# EAGLE design S12G_Micro_20EVB_RevA (EAGLE 6.1)
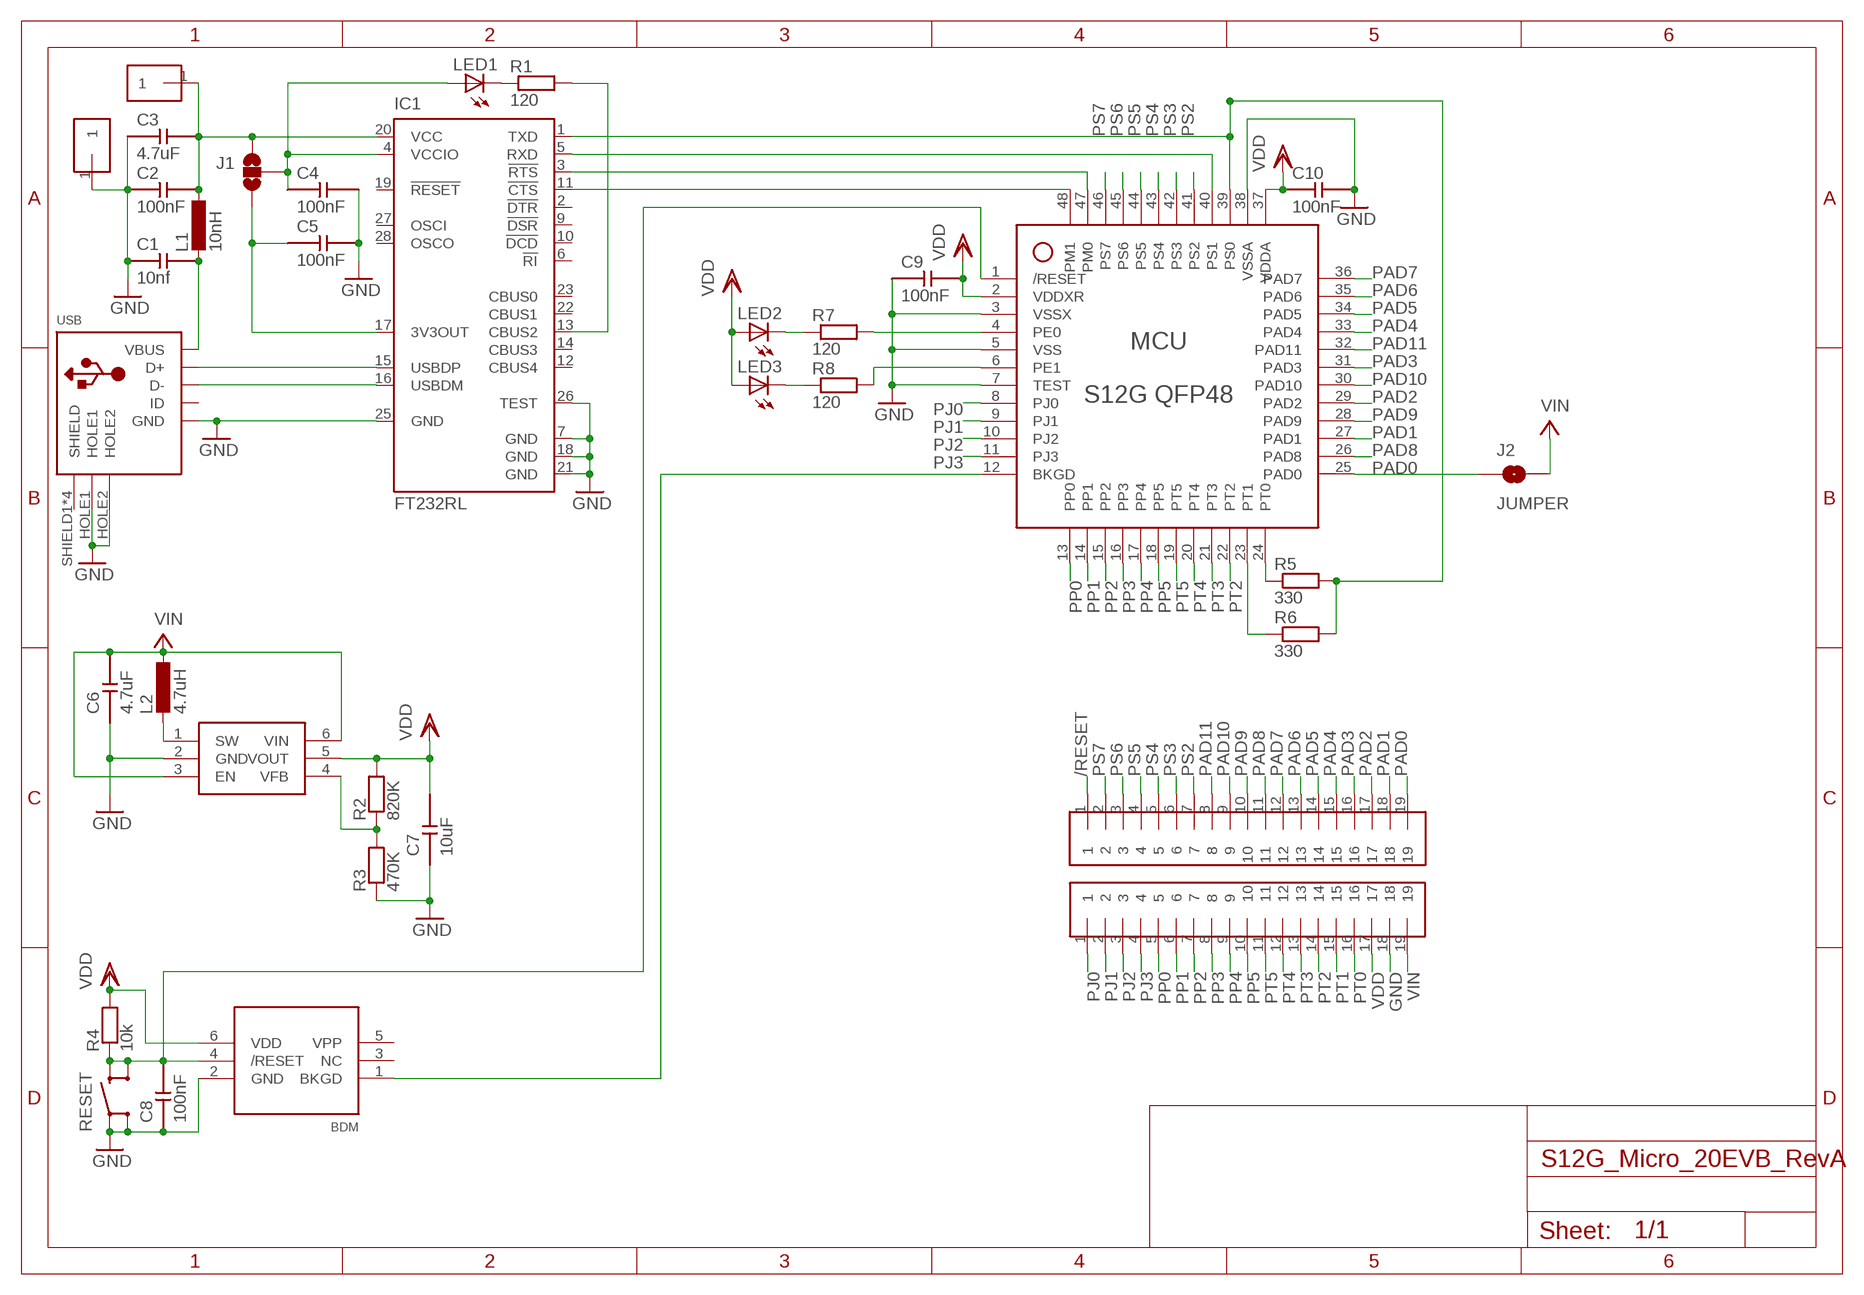
[diagram p0: schematic, sheet 1]

## Parts
BDM  BDM  [BDM]
BOTTOM  1X19  [1X19]
C1  10nf  C  [0805]
C2  100nF  C  [0805]
C3  4.7uF  C  [0805]
C4  100nF  C  [0805]
C5  100nF  C  [0805]
C6  4.7uF  C  [0805]
C7  10uF  C  [0805]
C8  100nF  C  [0805]
C9  100nF  C  [0805]
C10  100nF  C  [0805]
GND  1X1  [1X1]
IC1  FT232RL  [SSOP28]
IC2  MCP1640  [SOT23-6]
J1  JUMPER_2WAY  [JUMPER_2WAY]
J2  JUMPER  [JUMPER]
L1  10nH  L0805  [0805]
L2  4.7uH  LQH3C  [LQH3C@1]
LED1  LED0805  [0805]
LED2  LED0805  [0805]
LED3  LED0805  [0805]
MCU  S12G QFP48  S12G_QFP48  [QFP44]
R1  120  R  [0805]
R2  820K  R  [0805]
R3  470K  R  [0805]
R4  10k  R  [0805]
R5  330  R  [0805]
R6  330  R  [0805]
R7  120  R  [0805]
R8  120  R  [0805]
RESET  BUTTON  [BUTTON]
TOP  1X19  [1X19]
USB  USB  [USB_MINI_B]
VUSB  1X1  [1X1]

## Nets
3V3OUT: C5.2 IC1.17(3V3OUT) J1.3
/RESET: BDM.4(/RESET) C8.1 MCU.1(/RESET) R4.2 RESET.2 RESET.4 TOP.1
BKGD: BDM.1(BKGD) MCU.12(BKGD)
CTS: IC1.11(!CTS) MCU.48(PM1)
GND: BDM.2(GND) BOTTOM.18 C1.2 C2.2 C3.2 C4.1 C5.1 C6.2 C7.2 C8.2 C9.2 C10.1 GND.1 IC1.7(GND) IC1.18(GND) IC1.21(GND) IC1.25(GND) IC1.26(TEST) IC2.2(GND) MCU.3(VSSX) MCU.5(VSS) MCU.7(TEST) MCU.38(VSSA) R3.2 RESET.1 RESET.3 USB.GND USB.HOLE1 USB.HOLE2
N$1: LED3.2(C) R8.2
N$2: IC2.4(VFB) R2.2 R3.1
N$3: LED2.2(C) R7.2
N$8: LED1.2(C) R1.2
N$9: IC1.13(CBUS2) R1.1
N$11: IC2.1(SW) L2.3 L2.4
PAD0: J2.1 MCU.25(PAD0) TOP.19
PAD1: MCU.27(PAD1) TOP.18
PAD2: MCU.29(PAD2) TOP.17
PAD3: MCU.31(PAD3) TOP.16
PAD4: MCU.33(PAD4) TOP.15
PAD5: MCU.34(PAD5) TOP.14
PAD6: MCU.35(PAD6) TOP.13
PAD7: MCU.36(PAD7) TOP.12
PAD8: MCU.26(PAD8) TOP.11
PAD9: MCU.28(PAD9) TOP.10
PAD10: MCU.30(PAD10) TOP.9
PAD11: MCU.32(PAD11) TOP.8
PE0: MCU.4(PE0) R7.1
PE1: MCU.6(PE1) R8.1
PJ0: BOTTOM.1 MCU.8(PJ0)
PJ1: BOTTOM.2 MCU.9(PJ1)
PJ2: BOTTOM.3 MCU.10(PJ2)
PJ3: BOTTOM.4 MCU.11(PJ3)
PP0: BOTTOM.5 MCU.13(PP0)
PP1: BOTTOM.6 MCU.14(PP1)
PP2: BOTTOM.7 MCU.15(PP2)
PP3: BOTTOM.8 MCU.16(PP3)
PP4: BOTTOM.9 MCU.17(PP4)
PP5: BOTTOM.10 MCU.18(PP5)
PS2: MCU.41(PS2) TOP.7
PS3: MCU.42(PS3) TOP.6
PS4: MCU.43(PS4) TOP.5
PS5: MCU.44(PS5) TOP.4
PS6: MCU.45(PS6) TOP.3
PS7: MCU.46(PS7) TOP.2
PT0: BOTTOM.16 MCU.24(PT0) R5.2
PT1: BOTTOM.15 MCU.23(PT1) R6.2
PT2: BOTTOM.14 MCU.22(PT2)
PT3: BOTTOM.13 MCU.21(PT3)
PT4: BOTTOM.12 MCU.20(PT4)
PT5: BOTTOM.11 MCU.19(PT5)
RTS: IC1.3(!RTS) MCU.47(PM0)
RXD: IC1.1(TXD) MCU.39(PS0) R5.1 R6.1
TXD: IC1.5(RXD) MCU.40(PS1)
USBDN: IC1.16(USBDM) USB.D-
USBDP: IC1.15(USBDP) USB.D+
VBUS: C1.1 L1.2 USB.VBUS
VCCIO: C4.2 IC1.4(VCCIO) J1.2 LED1.1(A)
VDD: BDM.6(VDD) BOTTOM.17 C7.1 C9.1 C10.2 IC2.5(VOUT) LED2.1(A) LED3.1(A) MCU.2(VDDXR) MCU.37(VDDA) R2.1 R4.1
VDDUSB: C2.1 C3.1 IC1.20(VCC) J1.1 L1.1 VUSB.1
VIN: BOTTOM.19 C6.1 IC2.3(EN) IC2.6(VIN) J2.2 L2.1 L2.5
Unconnected: BDM.3(NC) BDM.5(VPP) IC1.2(!DTR) IC1.6(!RI) IC1.9(!DSR) IC1.10(!DCD) IC1.12(CBUS4) IC1.14(CBUS3) IC1.19(!RESET) IC1.22(CBUS1) IC1.23(CBUS0) IC1.27(OSCI) IC1.28(OSCO) USB.ID

## Power pins joined to a net without a drawn wire
SHIELD: USB.SHIELD1(SHIELD) USB.SHIELD2(SHIELD) USB.SHIELD3(SHIELD) USB.SHIELD4(SHIELD)

## Library data of the parts
BDM = myLibrary:BDM
BOTTOM TOP = myLibrary:1X19
C1-C10 = myLibrary:C
GND VUSB = myLibrary:1X1
IC1 = ftdichip:FT232R: Source: http://www.ftdichip.com/Documents/DataSheets/DS_FT232R_v104.pdf; MPN: FT232RL; OC_FARNELL: 1146032; OC_NEWARK: 91K9918
IC2 = myLibrary:MCP1640
J1 = myLibrary:JUMPER_2WAY
J2 = myLibrary:JUMPER
L1 = myLibrary:L
L2 = myLibrary:LQH3C
LED1-LED3 = myLibrary:LED
MCU = myLibrary:S12G_QFP48
R1-R8 = myLibrary:R
RESET = myLibrary:BUTTON
USB = myLibrary:USB

## Board
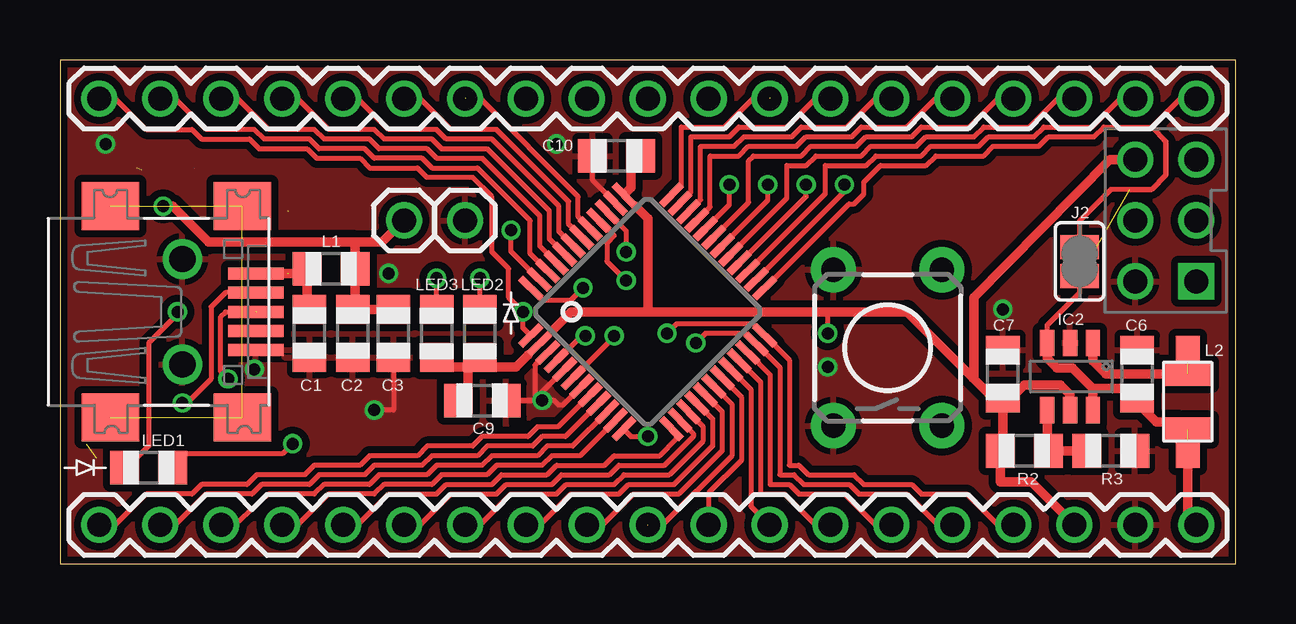
[diagram p1: board, top side]
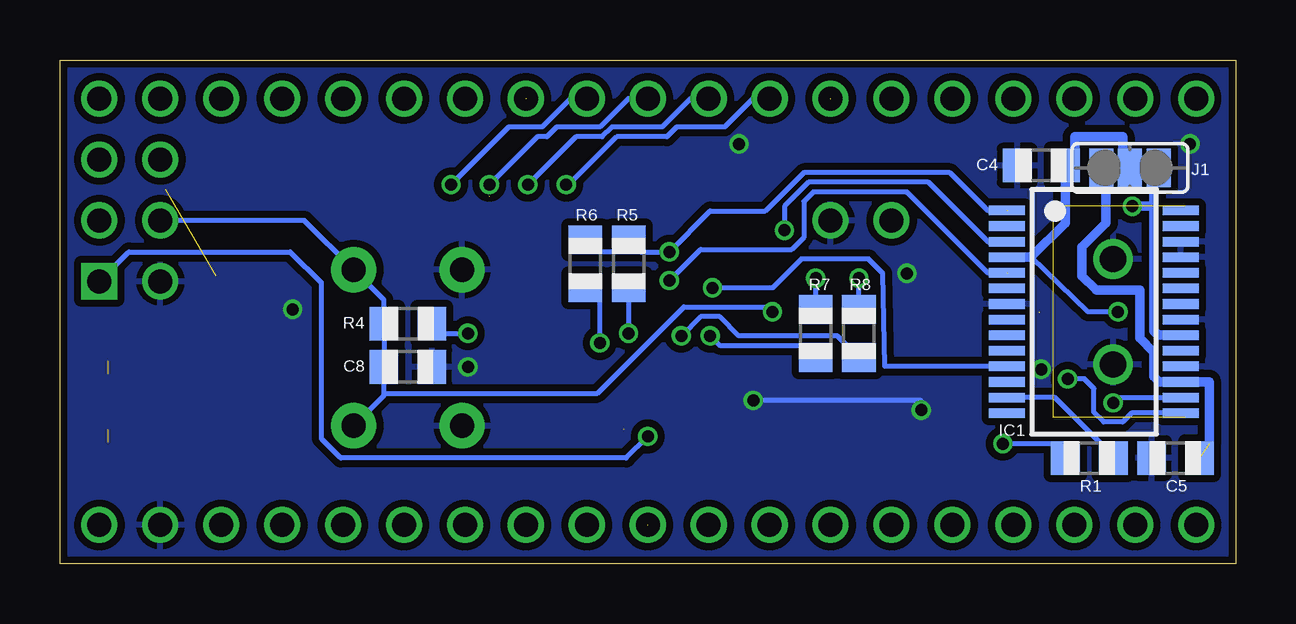
[diagram p2: board, bottom side, seen from below]

Size 49 x 21 mm. Coordinates in mm from the lower left corner, seen from the top.
Outline: 0,0 49,0 49,21 0,21 0,0
Copper layers (1*16): Top 0.035mm / dielectric 1.5mm / Bottom 0.035mm
Design rules: minimum track width 6mil, minimum drill 12mil, track to track 6mil, track to pad 6mil, pad to pad 6mil, via to via 6mil, smd to smd 0mil, copper to edge 10mil, drill to drill 10mil, minimum pad ring 10mil, minimum via ring 6mil, stop-mask expansion 2mil, vias tented up to drill 100mil, thermal gap 10mil

### Footprints (pad centres in the part's own frame; a part is rotated, then mirrored left to right if it is on the bottom)
BDM = drill 1 square: 1 -1.27,2.54 | drill 1: 2 1.27,2.54; 3 -1.27,0; 4 1.27,0; 5 -1.27,-2.54; 6 1.27,-2.54
1X19 = drill 1: 1 0,0; 2 2.54,0; 3 5.08,0; 4 7.62,0; 5 10.16,0; 6 12.7,0; 7 15.24,0; 8 17.78,0; 9 20.32,0; 10 22.86,0; 11 25.4,0; 12 27.94,0; 13 30.48,0; 14 33.02,0; 15 35.56,0; 16 38.1,0; 17 40.64,0; 18 43.18,0; 19 45.72,0
0805 = smd 1.2 x 1.4: 1 -1,0; 2 1,0
1X1 = drill 1: 1 0,0
SSOP28 = smd 0.4 x 1.5: 1 -4.225,-3.625; 2 -3.575,-3.625; 3 -2.925,-3.625; 4 -2.275,-3.625; 5 -1.625,-3.625; 6 -0.975,-3.625; 7 -0.325,-3.625; 8 0.325,-3.625; 9 0.975,-3.625; 10 1.625,-3.625; 11 2.275,-3.625; 12 2.925,-3.625; 13 3.575,-3.625; 14 4.225,-3.625; 15 4.225,3.625; 16 3.575,3.625; 17 2.925,3.625; 18 2.275,3.625; 19 1.625,3.625; 20 0.975,3.625; 21 0.325,3.625; 22 -0.325,3.625; 23 -0.975,3.625; 24 -1.625,3.625; 25 -2.275,3.625; 26 -2.925,3.625; 27 -3.575,3.625; 28 -4.225,3.625
SOT23-6 = smd 0.6 x 1.1: 1 -0.95,-1.4; 2 0,-1.4; 3 0.95,-1.4; 4 0.95,1.4; 5 0,1.4; 6 -0.95,1.4
JUMPER_2WAY = smd 1 x 1.6: 1 -1.2,0; 2 0,0; 3 1.2,0
JUMPER = smd 1 x 1.6: 1 -0.6,0; 2 0.6,0
LQH3C@1 = smd 1 x 2: 1 -1.1,0; 3 1.2,0 | smd 2.1 x 1: 4 1.75,0; 5 -1.65,0
QFP44 = smd 1.2 x 0.3: 1 -4.15,2.75; 2 -4.15,2.25; 3 -4.15,1.75; 4 -4.15,1.25; 5 -4.15,0.75; 6 -4.15,0.25; 7 -4.15,-0.25; 8 -4.15,-0.75; 9 -4.15,-1.25; 10 -4.15,-1.75; 11 -4.15,-2.25; 12 -4.15,-2.75; 25 4.15,-2.75; 26 4.15,-2.25; 27 4.15,-1.75; 28 4.15,-1.25; 29 4.15,-0.75; 30 4.15,-0.25; 31 4.15,0.25; 32 4.15,0.75; 33 4.15,1.25; 34 4.15,1.75; 35 4.15,2.25; 36 4.15,2.75 | smd 0.3 x 1.2: 13 -2.75,-4.15; 14 -2.25,-4.15; 15 -1.75,-4.15; 16 -1.25,-4.15; 17 -0.75,-4.15; 18 -0.25,-4.15; 19 0.25,-4.15; 20 0.75,-4.15; 21 1.25,-4.15; 22 1.75,-4.15; 23 2.25,-4.15; 24 2.75,-4.15; 37 2.75,4.15; 38 2.25,4.15; 39 1.75,4.15; 40 1.25,4.15; 41 0.75,4.15; 42 0.25,4.15; 43 -0.25,4.15; 44 -0.75,4.15; 45 -1.25,4.15; 46 -1.75,4.15; 47 -2.25,4.15; 48 -2.75,4.15
BUTTON = drill 1.016 pad 1.88: 1 -3.251,2.261; 2 -3.251,-2.261; 3 3.251,2.261; 4 3.251,-2.261
USB_MINI_B = smd 0.5 x 2.308: D+ 0,4.064; D- -0.8,4.064; GND 1.6,4.064; ID 0.8,4.064; VBUS -1.6,4.064 | drill 1.1: HOLE1 -2.2,1; HOLE2 2.2,1 | smd 2 x 2.4: SHIELD1 -4.4,-2; SHIELD2 -4.4,3.5; SHIELD3 4.4,3.5; SHIELD4 4.4,-2

### Placement (x,y rotation side)
BDM  46.09,14.31 180 top
BOTTOM  1.64,1.61 0 top
C1  10.4,9.6 270 top
C2  12.2,9.6 270 top
C3  13.9,9.6 270 top
C4  8.1,16.6 0 bottom
C5  2.5,4.4 0 bottom
C6  44.9,7.9 90 top
C7  39.3,7.9 90 top
C8  34.5,8.2 0 bottom
C9  17.6,6.8 0 top
C10  23.2,17 0 top
GND  16.88,14.31 0 top
IC1  5.9,10.5 270 bottom
IC2  42.1,7.8 180 top
J1  4.4,16.5 180 bottom
J2  42.5,12.6 270 top
L1  11.3,12.3 180 top
L2  47,6.7 90 top
LED1  3.7,4 0 top
LED2  17.5,9.6 90 top
LED3  15.7,9.6 90 top
MCU  24.5,10.5 45 top
R1  6.1,4.4 180 bottom
R2  40.2,4.7 0 top
R3  43.8,4.7 0 top
R4  34.5,10 180 bottom
R5  25.3,12.5 270 bottom
R6  27.1,12.5 270 bottom
R7  17.5,9.6 90 bottom
R8  15.7,9.6 90 bottom
RESET  34.5,9 90 top
TOP  1.64,19.39 0 top
USB  4.1,10.5 270 top
VUSB  14.34,14.31 0 top

### Tracks (layer width: path | path; a pad name or v marks a point on that pad's centre or on a via)
3V3OUT  (2 unrouted)
  Bottom 0.4: 1.1,5 1.1,7.57 IC1.17 3.17,7.57 3.4,7.8 3.4,8.8 4,9.4 4,11.4 5.8,11.4 6.4,12 6.4,13.2 5.4,14.2 5.4,16.29 5.6,16.48
/RESET  (via drill 0.5)
  Top 0.2: TOP.1 2.31,19.39 3.6,18.1 5.5,18.1 5.9,17.7 7.9,17.7 8.3,17.3 10.3,17.3 10.7,16.9 12.5,16.9 12.9,16.5 14.9,16.5 15.3,16.1 17.2,16.1 18,15.3 18,13 18.7,12.3 18.7,11.1 v19.3,10.5 19.3,9.83 MCU.1
  Bottom 0.2: RESET.2 35.5,7.01 35.5,7.1 | 35.5,7.1 C8.1 R4.2 35.5,10.99 RESET.4 38.82,14.31 BDM.4 | 35.5,7.1 26.6,7.1 23,10.7 19.5,10.7 v19.3,10.5
BKGD  (via drill 0.5)
  Top 0.2: MCU.12 23.5,5.6 23.8,5.3 v24.5,5.3
  Bottom 0.2: v24.5,5.3 25.4,4.4 37.3,4.4 38.1,5.2 38.1,11.7 39.4,13 46.13,13 BDM.1
CTS  (via drill 0.5)
  Top 0.2: MCU.48 20.11,11 21.3,11 v21.8,11.5
  Bottom 0.2: IC1.11 14.62,8.22 14.7,12.1 15.3,12.7 18.1,12.7 19.3,11.5 v21.8,11.5
GND  (via drill 0.5)
  Top 0.2: MCU.5 19.74,6.8 C9.2 | MCU.7 20.95,6.6 20.8,6.6 20.6,6.8 v20.1,6.8 C9.2 | MCU.3 19.8,8.28 19.8,6.8 C9.2 | MCU.38 22.2,15.98 C10.1 | C3.2 13.9,6.4 v13.1,6.4
  Bottom 0.2: v13.1,6.4 13.1,6.8 v20.1,6.8
  other vias: 20.7,17.5 39.3,10.6 32,8.2 1.9,17.5 13.7,12.1 8.1,8.1
  pour Bottom (isolate 0.3): 0.3,0.2 48.7,0.2 48.7,20.8 0.3,20.8
  pour Top (isolate 0.3): 0.3,0.2 48.7,0.2 48.7,20.8 0.3,20.8
N$1  (via drill 0.5)
  Top 0.2: LED3.2 v15.7,11.9
  Bottom 0.2: LED3.2 v15.7,11.9
N$2
  Top 0.4: R3.1 R2.2 41.15,4.75 IC2.4
N$3  (via drill 0.5)
  Top 0.2: R7.2 v17.5,11.9
  Bottom 0.2: R7.2 v17.5,11.9
N$8  (via drill 0.5)
  Top 0.2: LED1.2 5,4.3 5,4.6 9.3,4.6 v9.7,5
  Bottom 0.2: 7.1,4.3 R1.2 7.1,5 v9.7,5
N$9
  Bottom 0.2: R1.1 5.1,4.5 7.53,6.93 IC1.13
N$11  (1 unrouted)
  Top 0.4: 43.1,9.2 IC2.1 43.05,8.45 43.6,7.9 L2.3
PAD0
  Top 0.2: 45.5,18.2 46.69,19.39 TOP.19 | MCU.25 32.89,15 33.1,15 33.5,15.4 33.5,15.9 34.2,16.6 36.1,16.6 36.5,17 38.5,17 38.9,17.4 40.8,17.4 41.2,17.8 43.1,17.8 43.5,18.2 45.5,18.2 | J2.1 42.5,14.3 43.8,15.6 45.5,15.6 46.1,16.2 46.1,17.6 45.5,18.2
PAD1
  Top 0.2: TOP.18 44.19,19.39 43,18.2 41,18.2 40.6,17.8 38.7,17.8 38.3,17.4 36.3,17.4 35.9,17 34,17 33.6,16.6 31.9,16.6 31.9,15.43 MCU.27
PAD2
  Top 0.2: TOP.17 41.59,19.39 40.4,18.2 38.5,18.2 38.1,17.8 36.1,17.8 35.7,17.4 33.8,17.4 33.4,17 31.5,17 31.1,16.6 30.3,16.6 30.3,15.24 MCU.29
PAD3
  Top 0.2: TOP.16 39.09,19.39 37.9,18.2 35.9,18.2 35.5,17.8 33.6,17.8 33.2,17.4 31.3,17.4 30.9,17 28.9,17 28.7,16.8 28.7,15.05 MCU.31
PAD4
  Top 0.2: MCU.33 27.1,14.87 27.1,17 28.3,17 28.7,17.4 30.7,17.4 31.1,17.8 33,17.8 33.4,18.2 35.3,18.2 36.49,19.39 TOP.15
PAD5
  Top 0.2: MCU.34 26.7,15.18 26.7,17.4 28.1,17.4 28.5,17.8 30.5,17.8 30.9,18.2 32.8,18.2 33.99,19.39 TOP.14
PAD6
  Top 0.2: TOP.13 31.49,19.39 30.3,18.2 28.3,18.2 27.9,17.8 26.3,17.8 26.3,15.48 MCU.35
PAD7  (1 unrouted)
  Top 0.2: MCU.36 25.9,15.79 25.9,18.2 27.7,18.2 28.9,19.4 29.6,19.4
PAD8  (via drill 0.5)
  Top 0.2: MCU.26 32.7,15.52 v32.7,15.8
  Bottom 0.2: TOP.11 27.71,19.39 28.9,18.2 30.3,18.2 v32.7,15.8
PAD9  (via drill 0.5)  (1 unrouted)
  Top 0.2: 31.1,15.33 v31.1,15.8 | MCU.28 28.35,12.55 31.1,15.3
  Bottom 0.2: TOP.10 25.31,19.39 26.5,18.2 28.3,18.2 28.7,17.8 29.1,17.8 v31.1,15.8
PAD10  (via drill 0.5)
  Top 0.2: MCU.30 29.5,15.15 v29.5,15.8
  Bottom 0.2: TOP.9 22.71,19.39 23.9,18.2 26,18.2 26.4,17.8 27.5,17.8 v29.5,15.8
PAD11  (via drill 0.5)
  Top 0.2: MCU.32 27.9,14.96 v27.9,15.8
  Bottom 0.2: TOP.8 20.11,19.39 21.3,18.2 23.3,18.2 23.7,17.8 25.8,17.8 27.8,15.8 v27.9,15.8
PE0  (via drill 0.5)
  Top 0.2: MCU.4 21.73,9.5 v21.9,9.5
  Bottom 0.2: 17.5,9.1 R7.1 18,9.1 21.5,9.1 v21.9,9.5
PE1  (via drill 0.5)
  Top 0.2: MCU.6 23.1,9.45 v23.1,9.5
  Bottom 0.2: R8.1 16.6,9.5 20.7,9.5 21.5,10.3 22.3,10.3 v23.1,9.5
PJ0
  Top 0.2: MCU.8 20.76,5.7 19.9,5.7 19.5,5.3 17.6,5.3 17.2,4.9 15.3,4.9 14.9,4.5 12.9,4.5 12.5,4.1 10.6,4.1 10.2,3.7 8.2,3.7 7.8,3.3 5.9,3.3 5.5,2.9 3.6,2.9 2.31,1.61 BOTTOM.1
PJ1
  Top 0.2: BOTTOM.2 4.81,1.61 6.1,2.9 8,2.9 8.4,3.3 10.4,3.3 10.8,3.7 12.7,3.7 13.1,4.1 15.1,4.1 15.5,4.5 17.4,4.5 17.8,4.9 19.7,4.9 20.1,5.3 21.07,5.3 MCU.9
PJ2
  Top 0.2: BOTTOM.3 7.31,1.61 8.7,2.9 10.6,2.9 11,3.3 12.9,3.3 13.3,3.7 15.3,3.7 15.7,4.1 17.6,4.1 18,4.5 19.9,4.5 20.3,4.9 21.38,4.9 MCU.10
PJ3
  Top 0.2: BOTTOM.4 9.91,1.61 11.2,2.9 13.1,2.9 13.5,3.3 15.5,3.3 15.9,3.7 17.8,3.7 18.2,4.1 20.1,4.1 20.5,4.5 21.68,4.5 MCU.11
PP0  (1 unrouted)
  Top 0.2: BOTTOM.5 12.41,1.61 13.7,2.9 15.7,2.9 16.1,3.3 18,3.3 18.4,3.7 20.3,3.7 20.7,4.1 22.7,4.1 23.1,4.5 25,4.5 25.7,5.2 25.7,5.4 25.5,5.6
PP1
  Top 0.2: MCU.14 26.4,5.42 26.4,5.3 25.2,4.1 23.3,4.1 22.9,3.7 20.9,3.7 20.5,3.3 18.6,3.3 18.2,2.9 16.3,2.9 15.01,1.61 BOTTOM.6
PP2
  Top 0.2: MCU.15 26.8,5.72 26.8,5.1 25.4,3.7 23.5,3.7 23.1,3.3 21.1,3.3 20.7,2.9 18.8,2.9 17.51,1.61 BOTTOM.7
PP3
  Top 0.2: MCU.16 27.2,6.03 27.2,4.9 25.6,3.3 23.7,3.3 23.3,2.9 21.3,2.9 20.01,1.61 BOTTOM.8
PP4
  Top 0.2: MCU.17 27.6,6.34 27.6,4.7 25.8,2.9 23.9,2.9 22.61,1.61 BOTTOM.9
PP5  (1 unrouted)
  Top 0.2: MCU.18 28,6.65 28,4.5 25.1,1.6 BOTTOM.10
PS2  (1 unrouted)
  Top 0.2: MCU.41 21.6,14.46 21.6,15.3 17.5,19.4 16.9,19.4
PS3
  Top 0.2: TOP.6 15.01,19.39 16.3,18.1 18.2,18.1 21.2,15.1 21.2,14.15 MCU.42
PS4
  Top 0.2: TOP.5 12.41,19.39 13.7,18.1 15.7,18.1 16.1,17.7 18,17.7 20.8,14.9 20.8,13.85 MCU.43
PS5
  Top 0.2: TOP.4 9.91,19.39 11.2,18.1 13.1,18.1 13.5,17.7 15.5,17.7 15.9,17.3 17.8,17.3 20.4,14.7 20.4,13.54 MCU.44
PS6
  Top 0.2: TOP.3 7.41,19.39 8.7,18.1 10.6,18.1 11,17.7 12.9,17.7 13.3,17.3 15.3,17.3 15.7,16.9 17.6,16.9 20,14.5 20,13.23 MCU.45
PS7
  Top 0.2: TOP.2 4.81,19.39 6.1,18.1 8.1,18.1 8.5,17.7 10.4,17.7 10.8,17.3 12.7,17.3 13.1,16.9 15.1,16.9 15.5,16.5 17.4,16.5 19.6,14.3 19.6,12.93 MCU.46
PT0  (via drill 0.5)
  Top 0.2: BOTTOM.16 39.09,1.61 37.8,2.9 35.9,2.9 35.5,3.3 33.5,3.3 33.1,3.7 31.2,3.7 30.8,4.1 30.4,4.1 30.4,8.49 MCU.24 28.89,10 25.7,10 v25.3,9.6
  Bottom 0.2: R5.2 v25.3,9.6
PT1  (via drill 0.5)
  Top 0.2: BOTTOM.15 36.59,1.61 35.3,2.9 33.3,2.9 32.9,3.3 31,3.3 30.6,3.7 30,3.7 30,8.18 MCU.23 28.58,9.6 26.9,9.6 v26.5,9.2
  Bottom 0.2: v26.5,9.2 26.5,10.9 arc-90 R6.2
PT2
  Top 0.2: MCU.22 29.6,7.88 29.6,3.3 30.4,3.3 30.8,2.9 32.7,2.9 33.99,1.61 BOTTOM.14
PT3
  Top 0.2: MCU.21 29.2,7.57 29.2,2.9 30.2,2.9 31.49,1.61 BOTTOM.13
PT4
  Top 0.2: MCU.20 28.8,7.26 28.8,2.39 BOTTOM.12
PT5
  Top 0.2: MCU.19 28.4,6.95 28.4,4.3 27.04,2.94 BOTTOM.11
RTS  (via drill 0.5)
  Top 0.2: MCU.47 18.8,13.02 v18.8,13.9
  Bottom 0.2: IC1.3 9.55,13.4 10.3,13.4 12.8,15.9 17.8,15.9 18.8,14.9 v18.8,13.9
RXD  (via drill 0.5)  (1 unrouted)
  Top 0.2: MCU.39 23.6,13.88 v23.6,13
  Bottom 0.2: R6.1 27.1,13 25.8,13 R5.1 24.8,13 v23.6,13 21.9,14.7 19.6,14.7 18,16.3 11.9,16.3 10.3,14.7 9.5,14.7
SHIELD  (3 unrouted)
TXD  (via drill 0.5)  (1 unrouted)
  Top 0.2: MCU.40 23.1,13.67 22.8,13.37 22.8,12.6 v23.6,11.8
  Bottom 0.2: v23.6,11.8 22.3,13.1 18.5,13.1 18,13.6 18,15.1 17.6,15.5 13.7,15.5 10.3,12.1 9.5,12.1
USBDN  (via drill 0.5)
  Top 0.2: USB.D- 6.9,11.3 6.3,10.7 6.3,7.7 5.3,6.7 v5.1,6.7
  Bottom 0.2: v5.1,6.7 4.88,6.93 IC1.16
USBDP  (via drill 0.5)  (1 unrouted)
  Top 0.2: v7,7.7 6.7,8 6.7,10.3 6.9,10.5 8.2,10.5
  Bottom 0.2: IC1.15 4.33,6.28 4.7,5.9 5.5,5.9 5.9,6.3 5.9,7.3 6.3,7.7 v7,7.7
VBUS
  Top 0.4: USB.VBUS 10.3,12.1 L1.2 10.3,10.6 C1.1
VCCIO  (via drill 0.5)
  Top 0.2: v4.9,10.5 4.9,10.4 3.7,9.2 3.7,4.9 3.2,4.4 3.1,4.4
  Top 0.4: 3.1,4.4 LED1.1
  Bottom 0.2: v4.9,10.5 6.15,10.5 8.53,12.78
  Bottom 0.4: J1.2 4.4,17 4.7,17 4.7,17.8 6.7,17.8 6.7,17.1 7.1,17.1 C4.2 7.1,14.2 8.53,12.78 IC1.4
VDD  (via drill 0.5)
  Top 0.1: 38.99,4.61 R2.1
  Top 0.2: 20.5,9.7 20,9.2 20,9.18 MCU.2 19.52,8.7 | 23.99,14.9 MCU.37 23.6,15.47 | v32,9.6 32,10.5
  Top 0.4: IC2.5 42.1,7.05 41.7,7.45 40.2,7.45 39.85,7.1 39.3,7.1 | 39.3,7.1 C7.1 39.3,4.8 R2.1 39.2,3.4 40.49,3.4 BOTTOM.17 | 24.5,10.5 24.5,14.39 23.99,14.9 | 24.5,10.5 32,10.5 35.3,10.5 38.05,7.75 | 20.5,9.7 21.3,10.5 24.5,10.5 | 19.52,8.7 19.02,8.2 17.5,8.2 | LED3.1 15.7,8.2 17,8.2 | 17.5,8.2 LED2.1 | 23.6,15.47 23.8,15.67 23.8,16.6 C10.2 | 38.05,7.75 38.7,7.1 39.3,7.1 | BDM.6 43.75,16.85 38.1,11.1 38.1,7.75 38.05,7.75 | C9.1 17,7.2 17,8.2 | 17,8.2 17.5,8.2
  Bottom 0.2: 33.2,9.6 v32,9.6
  Bottom 0.4: R4.1 33.2,9.6
VDDUSB  (via drill 0.5)  (1 unrouted)
  Top 0.4: C3.1 C2.1 12.3,10.6 L1.1 12.3,13.4 | 12.3,13.4 6.2,13.4 4.7,14.9 v4.3,14.9 | 12.3,13.4 13.43,13.4 VUSB.1
  Bottom 0.4: 3.4,16.4 3.4,14.9 | 3.4,14.9 v4.3,14.9 | IC1.20 3.23,9.53 3.4,9.7 3.4,14.9
VIN  (2 unrouted)
  Top 0.1: L2.5 46.69,5.04 | 44.54,6.49 C6.1
  Top 0.2: 44.6,15.6 45.5,15.6 46.1,16.2 46.1,17.6 45.9,17.8 | IC2.3 41.15,9.95 42.5,11.3 J2.2
  Top 0.4: L2.5 47,1.97 BOTTOM.19 | IC2.3 41.15,8.55 41.55,8.15 42.2,8.15 43.05,7.3 | IC2.6 43.05,7.3 | 43.05,7.3 44.9,7.3 C6.1 44.9,6.7 45.7,5.9 46.7,5.9 L2.1

### Text on the board
tSilk: RES | RES | PS7 | PS6 | PS5 | PS4 | PS3 | PS2 | 11 | 10 | 9 | 8 | 7 | 6 | 5 | 4 | 3 | 2 | PAD | PAD | PAD | PAD | PAD | PAD | PAD | PAD | PAD | PAD | USB | V | GND | RESET | VIN to | PAD0 | PE1 | PE0 | XXXXX | S12G | RX/TX | PJ0 | PJ1 | PJ2 | PJ3 | PP0 | PP1 | PP2 | PP3 | PP4 | PP5 | PT5 | PT4 | PT3 | PT2 | PT1 | PT0 | VDD | GND | VIN
_bsilk: RES | RES | PS7 | PS6 | PS5 | PS4 | PS3 | PS2 | 11 | 10 | 9 | 8 | 7 | 6 | 5 | 4 | 3 | 2 | PAD | PAD | PAD | PAD | PAD | PAD | PAD | PAD | PAD | PAD | 5V | 3V3 | USB | GND | V | Rev. A | S12G Micro EVB | Dirk Heisswolf | PJ0 | PJ1 | PJ2 | PJ3 | PP0 | PP1 | PP2 | PP3 | PP4 | PP5 | PT5 | PT4 | PT3 | PT2 | PT1 | PT0 | VDD | GND | VIN